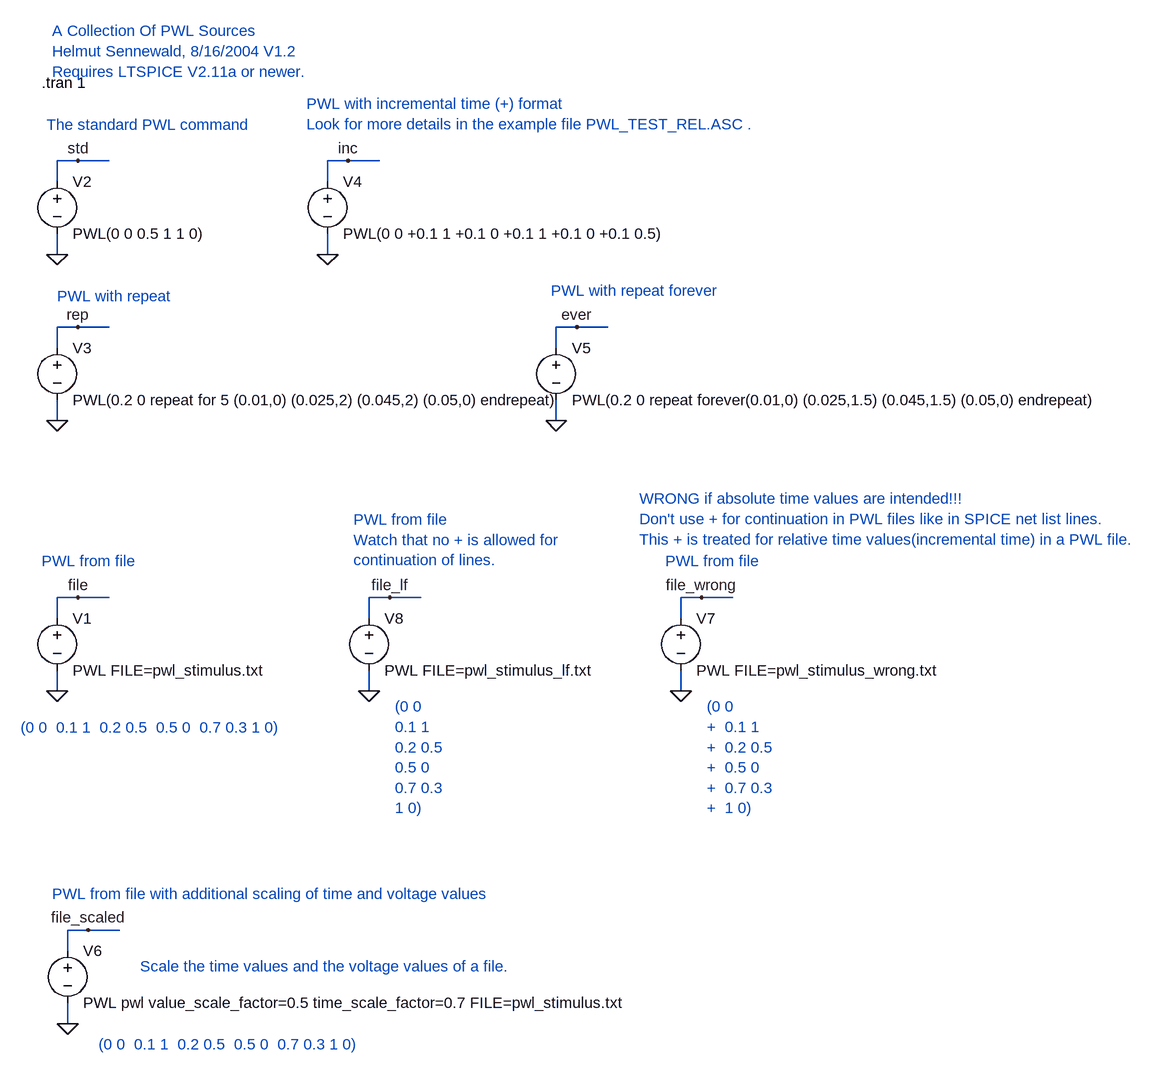
[diagram p0: schematic pwl_test.asc]
pwl_test.asc, the LTspice schematic file:
Version 4
SHEET 1 1896 960
WIRE -16 288 -16 256
WIRE -16 256 16 256
WIRE -16 368 -16 400
WIRE -16 -384 -16 -416
WIRE -16 -416 16 -416
WIRE -16 -304 -16 -272
WIRE 16 256 64 256
WIRE 16 -416 64 -416
WIRE -16 -128 -16 -160
WIRE -16 -160 16 -160
WIRE -16 -48 -16 -16
WIRE 16 -160 64 -160
WIRE 400 -384 400 -416
WIRE 400 -416 432 -416
WIRE 400 -304 400 -272
WIRE 432 -416 480 -416
WIRE 752 -128 752 -160
WIRE 752 -160 784 -160
WIRE 752 -48 752 -16
WIRE 784 -160 832 -160
WIRE 0 800 0 768
WIRE 0 768 32 768
WIRE 0 880 0 912
WIRE 32 768 80 768
WIRE 944 288 944 256
WIRE 944 256 976 256
WIRE 944 368 944 400
WIRE 976 256 1024 256
WIRE 464 288 464 256
WIRE 464 256 496 256
WIRE 464 368 464 400
WIRE 496 256 544 256
FLAG -16 400 0
FLAG -16 -272 0
FLAG 16 256 file
FLAG 16 -416 std
FLAG -16 -16 0
FLAG 16 -160 rep
FLAG 400 -272 0
FLAG 432 -416 inc
FLAG 752 -16 0
FLAG 784 -160 ever
FLAG 0 912 0
FLAG 32 768 file_scaled
FLAG 944 400 0
FLAG 976 256 file_wrong
FLAG 464 400 0
FLAG 496 256 file_lf
SYMBOL voltage -16 272 R0
WINDOW 123 0 0 Left 0
WINDOW 39 0 0 Left 0
SYMATTR InstName V1
SYMATTR Value PWL FILE=pwl_stimulus.txt
SYMBOL voltage -16 -400 R0
WINDOW 123 0 0 Left 0
WINDOW 39 0 0 Left 0
SYMATTR InstName V2
SYMATTR Value PWL(0 0 0.5 1 1 0)
SYMBOL voltage -16 -144 R0
WINDOW 123 0 0 Left 0
WINDOW 39 0 0 Left 0
SYMATTR InstName V3
SYMATTR Value PWL(0.2 0 repeat for 5 (0.01,0) (0.025,2) (0.045,2) (0.05,0) endrepeat)
SYMBOL voltage 400 -400 R0
WINDOW 123 0 0 Left 0
WINDOW 39 0 0 Left 0
SYMATTR InstName V4
SYMATTR Value PWL(0 0 +0.1 1 +0.1 0 +0.1 1 +0.1 0 +0.1 0.5)
SYMBOL voltage 752 -144 R0
WINDOW 123 0 0 Left 0
WINDOW 39 0 0 Left 0
SYMATTR InstName V5
SYMATTR Value PWL(0.2 0 repeat forever(0.01,0) (0.025,1.5) (0.045,1.5) (0.05,0) endrepeat)
SYMBOL voltage 0 784 R0
WINDOW 123 0 0 Left 0
WINDOW 39 0 0 Left 0
SYMATTR InstName V6
SYMATTR Value PWL pwl value_scale_factor=0.5 time_scale_factor=0.7 FILE=pwl_stimulus.txt
SYMBOL voltage 944 272 R0
WINDOW 123 0 0 Left 0
WINDOW 39 0 0 Left 0
SYMATTR InstName V7
SYMATTR Value PWL FILE=pwl_stimulus_wrong.txt
SYMBOL voltage 464 272 R0
WINDOW 123 0 0 Left 0
WINDOW 39 0 0 Left 0
SYMATTR InstName V8
SYMATTR Value PWL FILE=pwl_stimulus_lf.txt
TEXT -40 -536 Left 0 !.tran 1
TEXT -32 -472 Left 0 ;The standard PWL command
TEXT 368 -504 Left 0 ;PWL with incremental time (+) format\nLook for more details in the example file PWL_TEST_REL.ASC .
TEXT -40 200 Left 0 ;PWL from file
TEXT -16 -208 Left 0 ;PWL with repeat
TEXT 744 -216 Left 0 ;PWL with repeat forever
TEXT -24 -616 Left 0 ;A Collection Of PWL Sources\nHelmut Sennewald, 8/16/2004 V1.2\nRequires LTSPICE V2.11a or newer.
TEXT -24 712 Left 0 ;PWL from file with additional scaling of time and voltage values
TEXT 112 824 Left 0 ;Scale the time values and the voltage values of a file.
TEXT 48 944 Left 0 ;(0 0  0.1 1  0.2 0.5  0.5 0  0.7 0.3 1 0)
TEXT -72 456 Left 0 ;(0 0  0.1 1  0.2 0.5  0.5 0  0.7 0.3 1 0)
TEXT 920 200 Left 0 ;PWL from file
TEXT 984 424 Left 0 ;(0 0\n+  0.1 1  \n+  0.2 0.5\n+  0.5 0\n+  0.7 0.3\n+  1 0)
TEXT 504 424 Left 0 ;(0 0\n0.1 1  \n0.2 0.5\n0.5 0\n0.7 0.3\n1 0)
TEXT 440 136 Left 0 ;PWL from file\nWatch that no + is allowed for \ncontinuation of lines.
TEXT 880 104 Left 0 ;WRONG if absolute time values are intended!!!\nDon't use + for continuation in PWL files like in SPICE net list lines.\nThis + is treated for relative time values(incremental time) in a PWL file.

The netlist it stands for:
* pwl_test.asc
V1 file 0 PWL FILE=pwl_stimulus.txt
V2 std 0 PWL(0 0 0.5 1 1 0)
V3 rep 0 PWL(0.2 0 repeat for 5 (0.01,0) (0.025,2) (0.045,2) (0.05,0) endrepeat)
V4 inc 0 PWL(0 0 +0.1 1 +0.1 0 +0.1 1 +0.1 0 +0.1 0.5)
V5 ever 0 PWL(0.2 0 repeat forever(0.01,0) (0.025,1.5) (0.045,1.5) (0.05,0) endrepeat)
V6 file_scaled 0 PWL pwl value_scale_factor=0.5 time_scale_factor=0.7 FILE=pwl_stimulus.txt
V7 file_wrong 0 PWL FILE=pwl_stimulus_wrong.txt
V8 file_lf 0 PWL FILE=pwl_stimulus_lf.txt
.tran 1
* The standard PWL command
* PWL with incremental time (+) format
* Look for more details in the example file PWL_TEST_REL.ASC .
* PWL from file
* PWL with repeat
* PWL with repeat forever
* A Collection Of PWL Sources
* Helmut Sennewald, 8/16/2004 V1.2
* Requires LTSPICE V2.11a or newer.
* PWL from file with additional scaling of time and voltage values
* Scale the time values and the voltage values of a file.
* (0 0  0.1 1  0.2 0.5  0.5 0  0.7 0.3 1 0)
* (0 0  0.1 1  0.2 0.5  0.5 0  0.7 0.3 1 0)
* PWL from file
* (0 0
* +  0.1 1
* +  0.2 0.5
* +  0.5 0
* +  0.7 0.3
* +  1 0)
* (0 0
* 0.1 1
* 0.2 0.5
* 0.5 0
* 0.7 0.3
* 1 0)
* PWL from file
* Watch that no + is allowed for
* continuation of lines.
* WRONG if absolute time values are intended!!!
* Don't use + for continuation in PWL files like in SPICE net list lines.
* This + is treated for relative time values(incremental time) in a PWL file.
.backanno
.end